# EAGLE design bluz_proto_v2_revA (EAGLE 7.3.0)
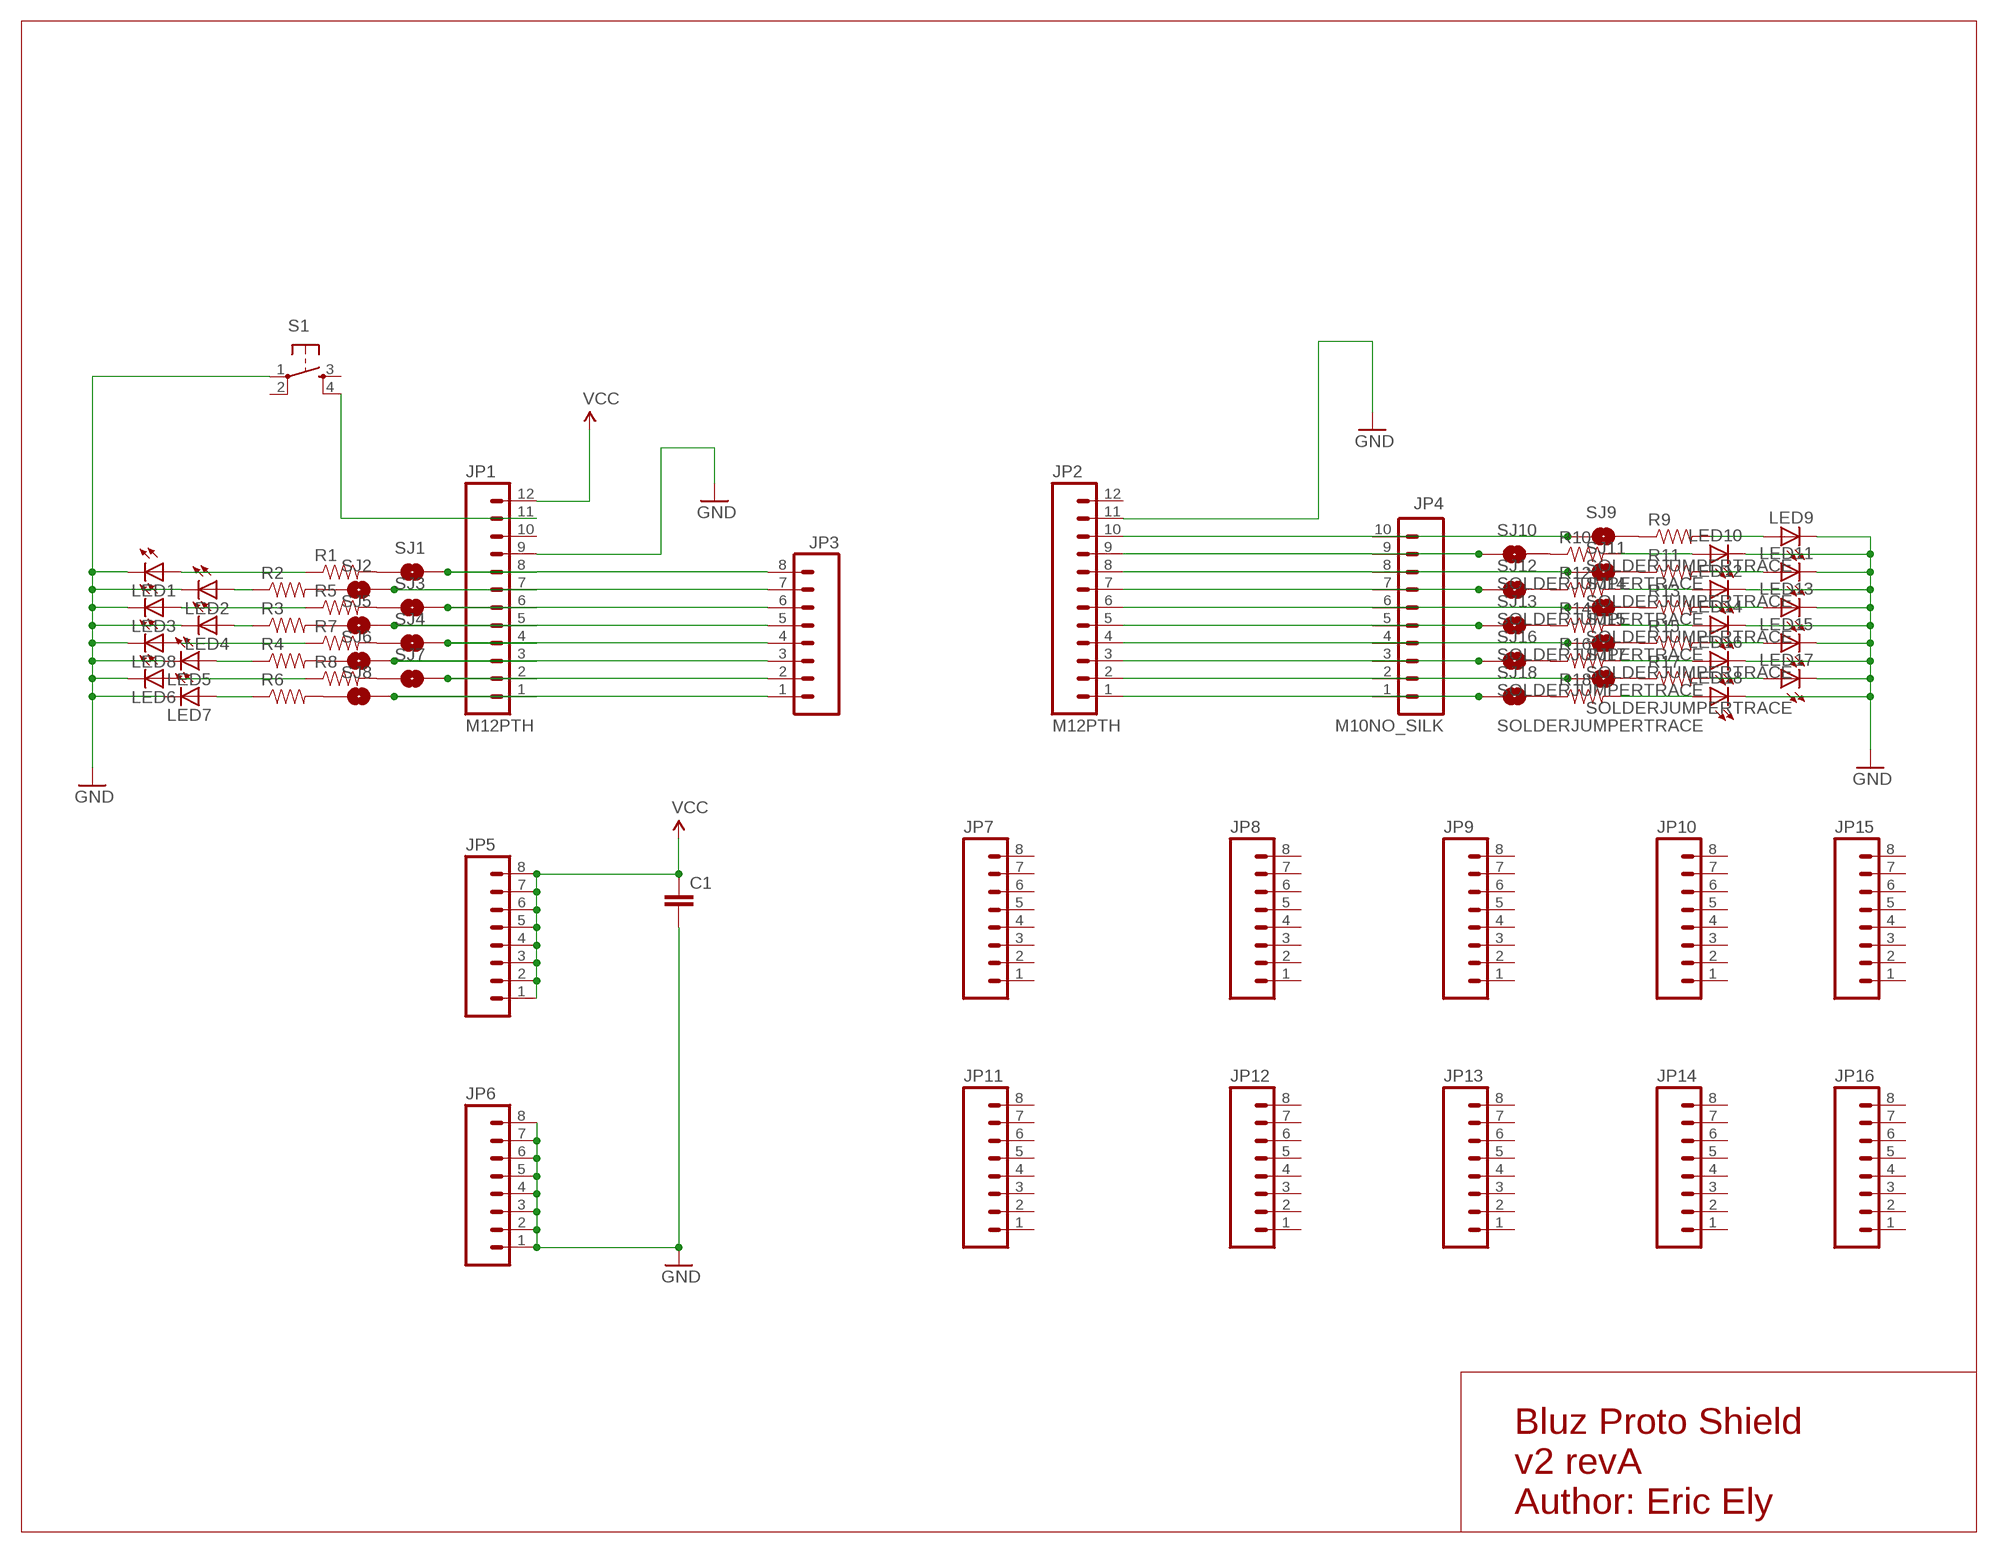
[diagram p0: schematic, sheet 1]

## Parts
C1  CAP0603-CAP  [0603-CAP]
JP1  M12PTH  [1X12]
JP2  M12PTH  [1X12]
JP3  M08NO_SILK  [1X08_NO_SILK]
JP4  M10NO_SILK  [1X10_NO_SILK]
JP5  M08NO_SILK  [1X08_NO_SILK]
JP6  M08NO_SILK  [1X08_NO_SILK]
JP7  M08NO_SILK  [1X08_NO_SILK]
JP8  M08NO_SILK  [1X08_NO_SILK]
JP9  M08NO_SILK  [1X08_NO_SILK]
JP10  M08NO_SILK  [1X08_NO_SILK]
JP11  M08NO_SILK  [1X08_NO_SILK]
JP12  M08NO_SILK  [1X08_NO_SILK]
JP13  M08NO_SILK  [1X08_NO_SILK]
JP14  M08NO_SILK  [1X08_NO_SILK]
JP15  M08NO_SILK  [1X08_NO_SILK]
JP16  M08NO_SILK  [1X08_NO_SILK]
LED1  LEDCHIP-LED0603  [CHIP-LED0603]
LED2  LEDCHIP-LED0603  [CHIP-LED0603]
LED3  LEDCHIP-LED0603  [CHIP-LED0603]
LED4  LEDCHIP-LED0603  [CHIP-LED0603]
LED5  LEDCHIP-LED0603  [CHIP-LED0603]
LED6  LEDCHIP-LED0603  [CHIP-LED0603]
LED7  LEDCHIP-LED0603  [CHIP-LED0603]
LED8  LEDCHIP-LED0603  [CHIP-LED0603]
LED9  LEDCHIP-LED0603  [CHIP-LED0603]
LED10  LEDCHIP-LED0603  [CHIP-LED0603]
LED11  LEDCHIP-LED0603  [CHIP-LED0603]
LED12  LEDCHIP-LED0603  [CHIP-LED0603]
LED13  LEDCHIP-LED0603  [CHIP-LED0603]
LED14  LEDCHIP-LED0603  [CHIP-LED0603]
LED15  LEDCHIP-LED0603  [CHIP-LED0603]
LED16  LEDCHIP-LED0603  [CHIP-LED0603]
LED17  LEDCHIP-LED0603  [CHIP-LED0603]
LED18  LEDCHIP-LED0603  [CHIP-LED0603]
R1  RESISTOR0603-RES  [0603-RES]
R2  RESISTOR0603-RES  [0603-RES]
R3  RESISTOR0603-RES  [0603-RES]
R4  RESISTOR0603-RES  [0603-RES]
R5  RESISTOR0603-RES  [0603-RES]
R6  RESISTOR0603-RES  [0603-RES]
R7  RESISTOR0603-RES  [0603-RES]
R8  RESISTOR0603-RES  [0603-RES]
R9  RESISTOR0603-RES  [0603-RES]
R10  RESISTOR0603-RES  [0603-RES]
R11  RESISTOR0603-RES  [0603-RES]
R12  RESISTOR0603-RES  [0603-RES]
R13  RESISTOR0603-RES  [0603-RES]
R14  RESISTOR0603-RES  [0603-RES]
R15  RESISTOR0603-RES  [0603-RES]
R16  RESISTOR0603-RES  [0603-RES]
R17  RESISTOR0603-RES  [0603-RES]
R18  RESISTOR0603-RES  [0603-RES]
S1  TAC_SWITCHSMD  [TACTILE_SWITCH_SMD]
SJ1  SOLDERJUMPERTRACE  [SJ_2S-TRACE]
SJ2  SOLDERJUMPERTRACE  [SJ_2S-TRACE]
SJ3  SOLDERJUMPERTRACE  [SJ_2S-TRACE]
SJ4  SOLDERJUMPERTRACE  [SJ_2S-TRACE]
SJ5  SOLDERJUMPERTRACE  [SJ_2S-TRACE]
SJ6  SOLDERJUMPERTRACE  [SJ_2S-TRACE]
SJ7  SOLDERJUMPERTRACE  [SJ_2S-TRACE]
SJ8  SOLDERJUMPERTRACE  [SJ_2S-TRACE]
SJ9  SOLDERJUMPERTRACE  [SJ_2S-TRACE]
SJ10  SOLDERJUMPERTRACE  [SJ_2S-TRACE]
SJ11  SOLDERJUMPERTRACE  [SJ_2S-TRACE]
SJ12  SOLDERJUMPERTRACE  [SJ_2S-TRACE]
SJ13  SOLDERJUMPERTRACE  [SJ_2S-TRACE]
SJ14  SOLDERJUMPERTRACE  [SJ_2S-TRACE]
SJ15  SOLDERJUMPERTRACE  [SJ_2S-TRACE]
SJ16  SOLDERJUMPERTRACE  [SJ_2S-TRACE]
SJ17  SOLDERJUMPERTRACE  [SJ_2S-TRACE]
SJ18  SOLDERJUMPERTRACE  [SJ_2S-TRACE]

## Nets
GND: C1.2 JP1.9 JP2.11 JP6.1 JP6.2 JP6.3 JP6.4 JP6.5 JP6.6 JP6.7 JP6.8 LED1.C LED2.C LED3.C LED4.C LED5.C LED6.C LED7.C LED8.C LED9.C LED10.C LED11.C LED12.C LED13.C LED14.C LED15.C LED16.C LED17.C LED18.C S1.1
N$1: JP1.1 JP3.1 SJ8.2
N$2: JP1.2 JP3.2 SJ7.2
N$3: JP1.3 JP3.3 SJ6.2
N$4: JP1.4 JP3.4 SJ4.2
N$5: JP1.5 JP3.5 SJ5.2
N$6: JP1.6 JP3.6 SJ3.2
N$7: JP1.7 JP3.7 SJ2.2
N$8: JP1.8 JP3.8 SJ1.2
N$9: JP2.1 JP4.1 SJ18.1
N$10: JP2.2 JP4.2 SJ17.1
N$11: JP2.3 JP4.3 SJ16.1
N$12: JP2.4 JP4.4 SJ15.1
N$13: JP2.5 JP4.5 SJ13.1
N$14: JP2.6 JP4.6 SJ14.1
N$15: JP2.7 JP4.7 SJ12.1
N$16: JP2.8 JP4.8 SJ11.1
N$17: JP2.9 JP4.9 SJ10.1
N$18: JP2.10 JP4.10 SJ9.1
N$19: LED6.A R8.1
N$20: R1.2 SJ1.1
N$21: R2.2 SJ2.1
N$22: R3.2 SJ5.1
N$23: R4.2 SJ6.1
N$24: R6.2 SJ8.1
N$25: R5.2 SJ3.1
N$26: R7.2 SJ4.1
N$27: R8.2 SJ7.1
N$28: LED1.A R1.1
N$29: LED2.A R2.1
N$30: LED3.A R5.1
N$31: LED4.A R3.1
N$32: LED5.A R4.1
N$33: LED7.A R6.1
N$34: LED8.A R7.1
N$35: R18.1 SJ18.2
N$36: R17.1 SJ17.2
N$37: R16.1 SJ16.2
N$38: R15.1 SJ15.2
N$39: R14.1 SJ13.2
N$40: R13.1 SJ14.2
N$41: R12.1 SJ12.2
N$42: R11.1 SJ11.2
N$43: R10.1 SJ10.2
N$44: R9.1 SJ9.2
N$45: LED9.A R9.2
N$46: LED10.A R10.2
N$47: LED11.A R11.2
N$48: LED12.A R12.2
N$49: LED13.A R13.2
N$50: LED14.A R14.2
N$51: LED15.A R15.2
N$52: LED16.A R16.2
N$53: LED17.A R17.2
N$54: LED18.A R18.2
N$56: JP1.11 S1.4
VCC: C1.1 JP1.12 JP5.1 JP5.2 JP5.3 JP5.4 JP5.5 JP5.6 JP5.7 JP5.8
Unconnected: JP1.10 JP2.12 JP7.1 JP7.2 JP7.3 JP7.4 JP7.5 JP7.6 JP7.7 JP7.8 JP8.1 JP8.2 JP8.3 JP8.4 JP8.5 JP8.6 JP8.7 JP8.8 JP9.1 JP9.2 JP9.3 JP9.4 JP9.5 JP9.6 JP9.7 JP9.8 JP10.1 JP10.2 JP10.3 JP10.4 JP10.5 JP10.6 JP10.7 JP10.8 JP11.1 JP11.2 JP11.3 JP11.4 JP11.5 JP11.6 JP11.7 JP11.8 JP12.1 JP12.2 JP12.3 JP12.4 JP12.5 JP12.6 JP12.7 JP12.8 JP13.1 JP13.2 JP13.3 JP13.4 JP13.5 JP13.6 JP13.7 JP13.8 JP14.1 JP14.2 JP14.3 JP14.4 JP14.5 JP14.6 JP14.7 JP14.8 JP15.1 JP15.2 JP15.3 JP15.4 JP15.5 JP15.6 JP15.7 JP15.8 JP16.1 JP16.2 JP16.3 JP16.4 JP16.5 JP16.6 JP16.7 JP16.8 S1.2 S1.3

## Notes on the sheet
- Bluz Proto Shield
  v2 revA
  Author: Eric Ely

## Library data of the parts
C1 = SparkFun-Capacitors:CAP: Capacitor Standard 0603 ceramic capacitor, and 0.1" leaded capacitor.
JP1 JP2 = SparkFun-Connectors:M12: Header 12 Standard 12-pin 0.1" header. Use with straight break away headers (SKU : PRT-00116), right angle break away headers (PRT-00553), swiss pins (PRT-00743), machine pins (PRT-00117), and female headers (PRT-00115).
JP3 JP5-JP16 = SparkFun-Connectors:M08: Header 8 Standard 8-pin 0.1" header. Use with straight break away headers (SKU : PRT-00116), right angle break away headers (PRT-00553), swiss pins (PRT-00743), machine pins (PRT-00117), and female headers (PRT-00115).
JP4 = SparkFun-Connectors:M10: Header 10 Standard 10-pin 0.1" header. Use with straight break away headers (SKU : PRT-00116), right angle break away headers (PRT-00553), swiss pins (PRT-00743), machine pins (PRT-00117), and female headers (PRT-00115).
LED1-LED18 = led:LED: LED OSRAM: - CHIPLED LG R971, LG N971, LY N971, LG Q971, LY Q971, LO R971, LY R971 LH N974, LH R974 LS Q976, LO Q976, LY Q976 LO Q996 - Hyper CHIPLED LW Q18S LB Q993, LB Q99A, LB R99A - SideLED LS A670, LO A670, LY A670, LG A670, LP A670 LB A673, LV A673, LT A673, LW A673 LH A674 LY A675 LS A676, LA A676, LO A676, LY A676, LW A676 LS A679, LY A679, LG A679 - Hyper Micro SIDELED® LS Y876, LA Y876, LO Y876, LY Y876 LT Y87S - SmartLED LW L88C, LW L88S LB L89C, LB L89S, LG L890 LS L89K, LO L89K, LY L89K LS L896, LA L896, LO L896, LY L896 - TOPLED LS T670, LO T670, LY T670, LG T670, LP T670 LSG T670, LSP T670, LSY T670, LOP T670, LYG T670 LG T671, LOG T671, LSG T671 LB T673, LV T673, LT T673, LW T673 LH T674 LS T676, LA T676, LO T676, LY T676, LB T676, LH T676, LSB T676, LW T676 LB T67C, LV T67C, LT T67C, LS T67K, LO T67K, LY T67K, LW E67C LS E67B, LA E67B, LO E67B, LY E67B, LB E67C, LV E67C, LT E67C LW T67C LS T679, LY T679, LG T679 LS T770, LO T770, LY T770, LG T770, LP T770 LB T773, LV T773, LT T773, LW T773 LH T774 LS E675, LA E675, LY E675, LS T675 LS T776, LA T776, LO T776, LY T776, LB T776 LHGB T686 LT T68C, LB T68C - Hyper Mini TOPLED® LB M676 - Mini TOPLED Santana® LG M470 LS M47K, LO M47K, LY M47K Source: http://www.osram.convergy.de LUXEON: - LUMILED® LXK2-PW12-R00, LXK2-PW12-S00, LXK2-PW14-U00, LXK2-PW14-V00 LXK2-PM12-R00, LXK2-PM12-S00, LXK2-PM14-U00 LXK2-PE12-Q00, LXK2-PE12-R00, LXK2-PE12-S00, LXK2-PE14-T00, LXK2-PE14-U00 LXK2-PB12-K00, LXK2-PB12-L00, LXK2-PB12-M00, LXK2-PB14-N00, LXK2-PB14-P00, LXK2-PB14-Q00 LXK2-PR12-L00, LXK2-PR12-M00, LXK2-PR14-Q00, LXK2-PR14-R00 LXK2-PD12-Q00, LXK2-PD12-R00, LXK2-PD12-S00 LXK2-PH12-R00, LXK2-PH12-S00 LXK2-PL12-P00, LXK2-PL12-Q00, LXK2-PL12-R00 Source: www.luxeon.com KINGBRIGHT: KA-3528ASYC Source: www.kingbright.com
R1-R18 = SparkFun-Passives:RESISTOR: Resistor Basic schematic elements and footprints for 0603, 1206, and PTH resistors.
S1 = Spark:TAC_SWITCH: SMD Tactiile Switch
SJ1-SJ18 = SparkFun-Passives:SOLDERJUMPER: Solder Jumper Standard SMD solder jumper. Used to automate production. Two varients : Normally Open and Normally Closed are the same, but have different paste layers. NC will have a large amount of paste and should jumper during reflow.

## Board
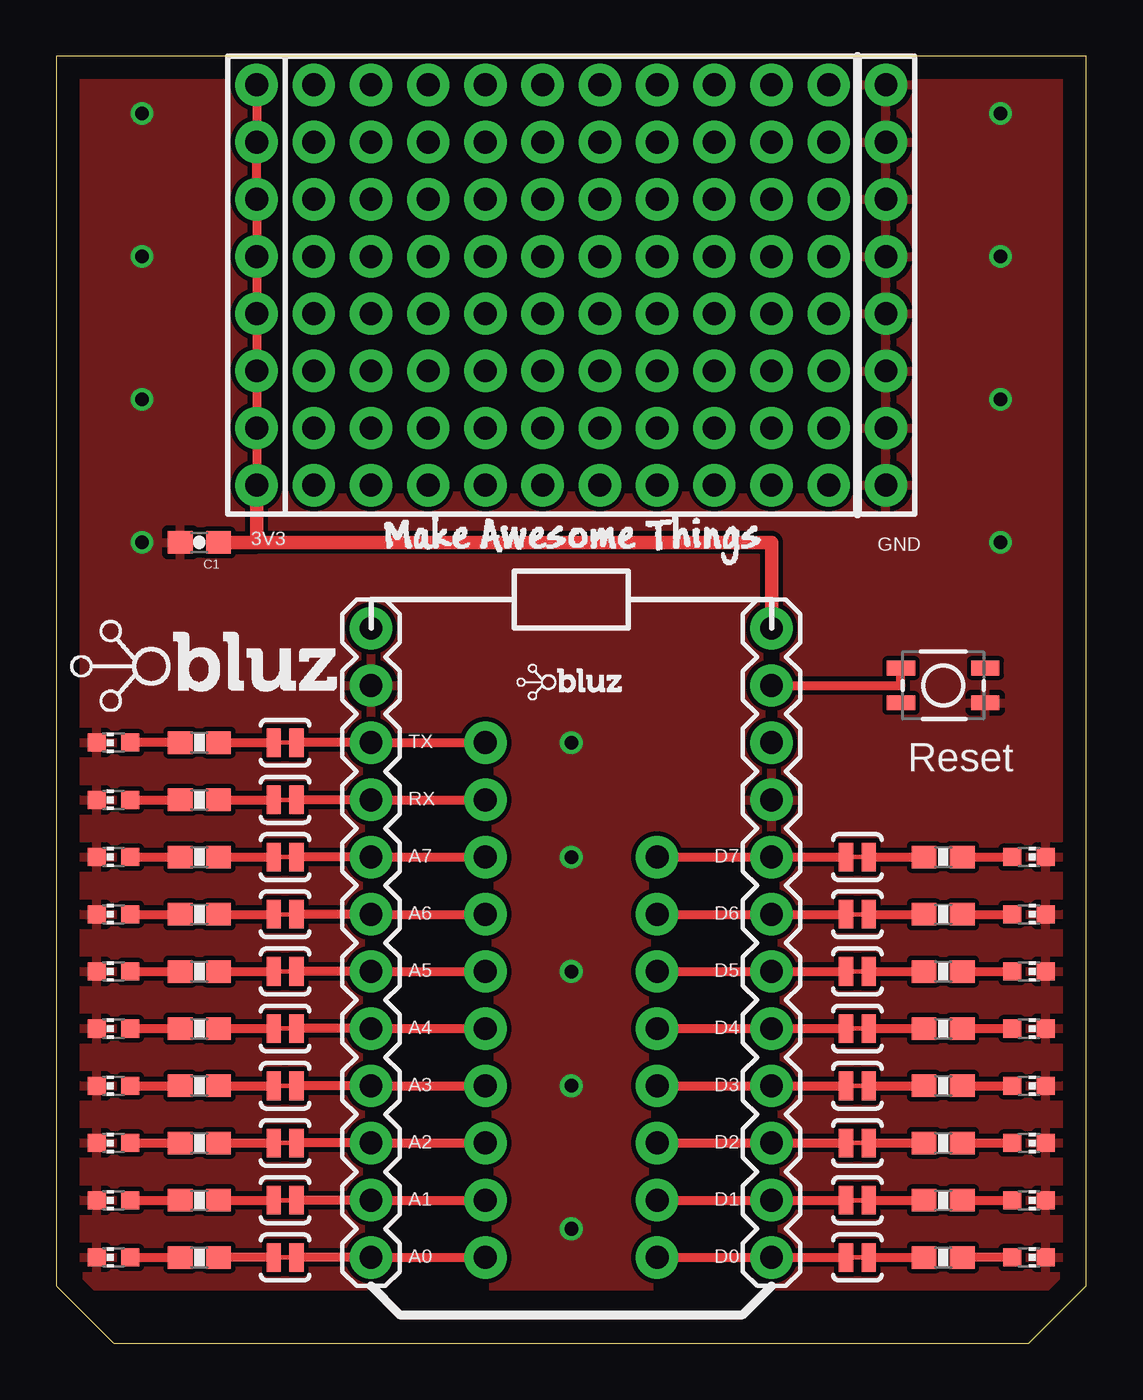
[diagram p1: board, top side]
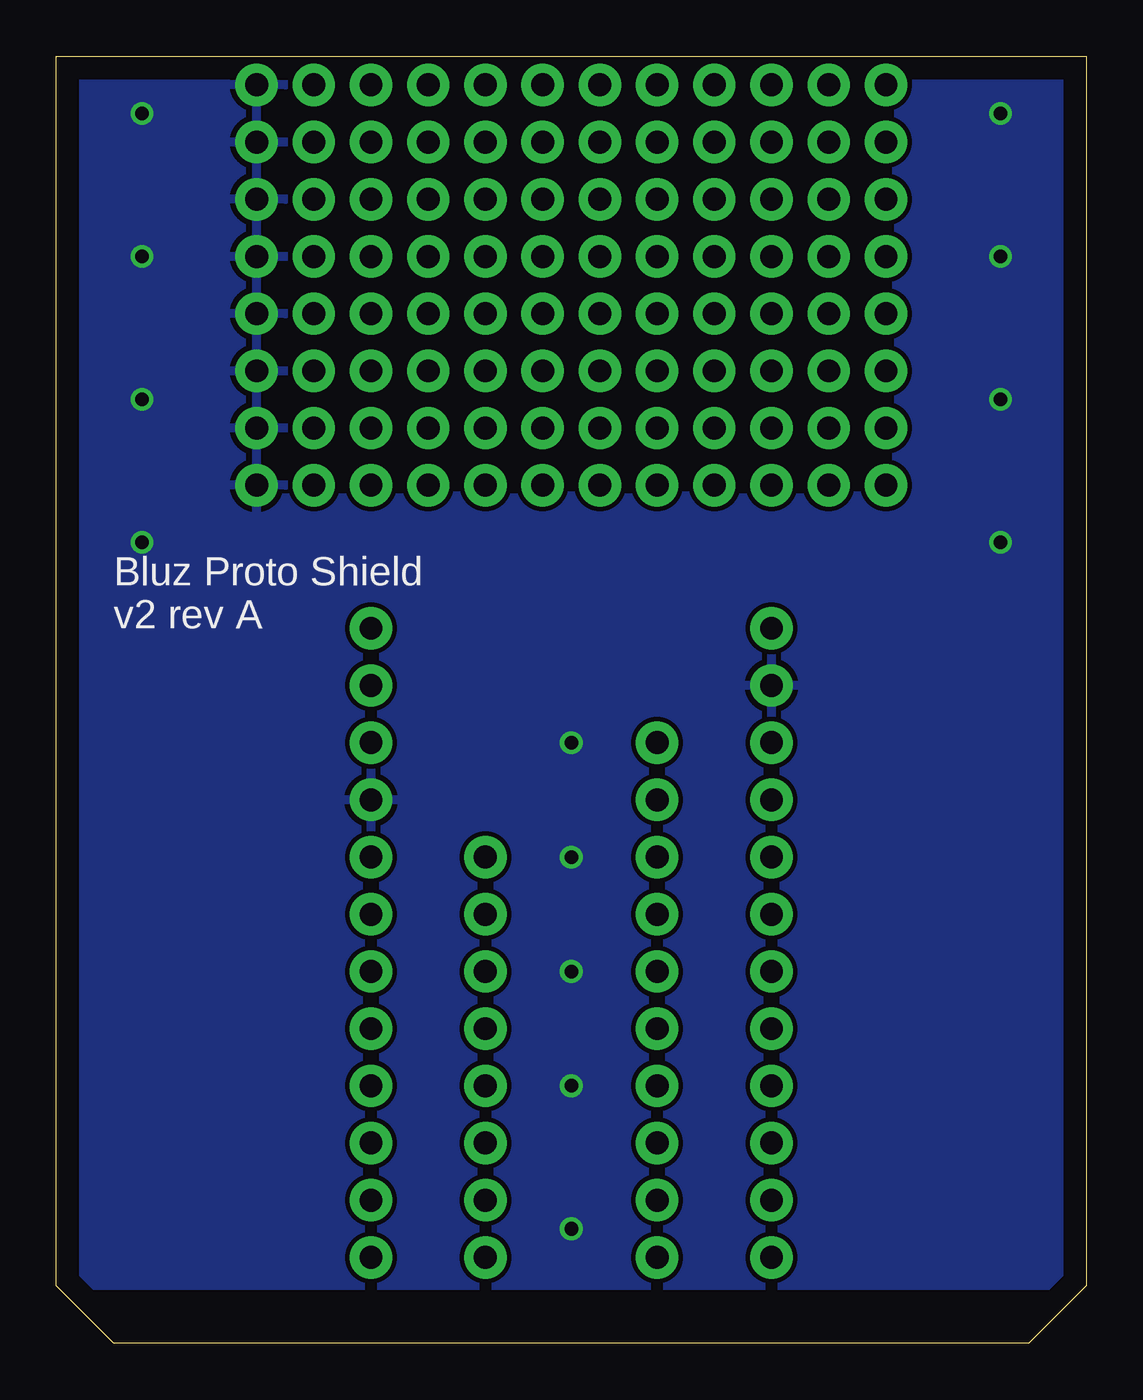
[diagram p2: board, bottom side, seen from below]

Size 45.72 x 57.15 mm. Coordinates in mm from the lower left corner, seen from the top.
Outline: 0,2.54 2.54,0 43.18,0 45.72,2.54 45.72,57.15 0,57.15 0,2.54
Copper layers (1*16): Top 0.035mm / dielectric 1.5mm / Bottom 0.035mm
Design rules "default": minimum track width 10mil, minimum drill 24mil, track to track 8mil, track to pad 8mil, pad to pad 8mil, via to via 8mil, smd to smd 8mil, copper to edge 40mil, drill to drill 8mil, minimum pad ring 10mil, minimum via ring 8mil, stop-mask expansion 4mil, vias tented up to drill 0mil, thermal gap 10mil

### Footprints (pad centres in the part's own frame; a part is rotated, then mirrored left to right if it is on the bottom)
0603-CAP = smd 1.1 x 1: 1 -0.85,0; 2 0.85,0
1X12 = drill 1.016 pad 1.88: 1 0,0; 2 2.54,0; 3 5.08,0; 4 7.62,0; 5 10.16,0; 6 12.7,0; 7 15.24,0; 8 17.78,0; 9 20.32,0; 10 22.86,0; 11 25.4,0; 12 27.94,0
1X08_NO_SILK = drill 1.016 pad 1.88: 1 0,0; 2 2.54,0; 3 5.08,0; 4 7.62,0; 5 10.16,0; 6 12.7,0; 7 15.24,0; 8 17.78,0
1X10_NO_SILK = drill 1.016 pad 1.88: 1 0,0; 2 2.54,0; 3 5.08,0; 4 7.62,0; 5 10.16,0; 6 12.7,0; 7 15.24,0; 8 17.78,0; 9 20.32,0; 10 22.86,0
CHIP-LED0603 = smd 0.8 x 0.8: A 0,-0.75; C 0,0.75
0603-RES = smd 1.1 x 1: 1 -0.85,0; 2 0.85,0
TACTILE_SWITCH_SMD = smd 1.25 x 0.65: 1 -1.875,0.775; 2 1.875,0.775; 3 -1.875,-0.775; 4 1.875,-0.775
SJ_2S-TRACE = smd 0.635 x 1.27: 1 -0.508,0; 2 0.508,0

### Placement (x,y rotation side)
C1  6.35,35.56 180 top
JP1  31.75,3.81 90 top
JP2  13.97,3.81 90 top
JP3  26.67,3.81 90 top
JP4  19.05,3.81 90 top
JP5  8.89,38.1 90 top
JP6  36.83,38.1 90 top
JP7  21.59,38.1 90 top
JP8  24.13,38.1 90 top
JP9  26.67,38.1 90 top
JP10  19.05,38.1 90 top
JP11  29.21,38.1 90 top
JP12  16.51,38.1 90 top
JP13  31.75,38.1 90 top
JP14  13.97,38.1 90 top
JP15  11.43,38.1 90 top
JP16  34.29,38.1 90 top
LED1  43.18,21.59 270 top
LED2  43.18,19.05 270 top
LED3  43.18,16.51 270 top
LED4  43.18,13.97 270 top
LED5  43.18,8.89 270 top
LED6  43.18,6.35 270 top
LED7  43.18,3.81 270 top
LED8  43.18,11.43 270 top
LED9  2.54,26.67 90 top
LED10  2.54,24.13 90 top
LED11  2.54,21.59 90 top
LED12  2.54,19.05 90 top
LED13  2.54,16.51 90 top
LED14  2.54,13.97 90 top
LED15  2.54,11.43 90 top
LED16  2.54,8.89 90 top
LED17  2.54,6.35 90 top
LED18  2.54,3.81 90 top
R1  39.37,21.59 180 top
R2  39.37,19.05 180 top
R3  39.37,13.97 180 top
R4  39.37,8.89 180 top
R5  39.37,16.51 180 top
R6  39.37,3.81 180 top
R7  39.37,11.43 180 top
R8  39.37,6.35 180 top
R9  6.35,26.67 180 top
R10  6.35,24.13 180 top
R11  6.35,21.59 180 top
R12  6.35,19.05 180 top
R13  6.35,16.51 180 top
R14  6.35,13.97 180 top
R15  6.35,11.43 180 top
R16  6.35,8.89 180 top
R17  6.35,6.35 180 top
R18  6.35,3.81 180 top
S1  39.37,29.21 180 top
SJ1  35.56,21.59 180 top
SJ2  35.56,19.05 180 top
SJ3  35.56,16.51 180 top
SJ4  35.56,11.43 180 top
SJ5  35.56,13.97 180 top
SJ6  35.56,8.89 180 top
SJ7  35.56,6.35 180 top
SJ8  35.56,3.81 180 top
SJ9  10.16,26.67 180 top
SJ10  10.16,24.13 180 top
SJ11  10.16,21.59 180 top
SJ12  10.16,19.05 180 top
SJ13  10.16,13.97 180 top
SJ14  10.16,16.51 180 top
SJ15  10.16,11.43 180 top
SJ16  10.16,8.89 180 top
SJ17  10.16,6.35 180 top
SJ18  10.16,3.81 180 top
U$2  [BLUZ_LOGO_BETTER]  0.64,28.07 0 top
U$3  [BLUZE_LOGO_LOW_RES]  20.45,28.57 0 top
U$4  [MAKE_X2]  14.22,34.54 0 top

### Tracks (layer width: path | path; a pad name or v marks a point on that pad's centre or on a via)
GND  (via drill 0.6)
  other vias: 3.81,54.61 3.81,48.26 3.81,41.91 3.81,35.56 41.91,54.61 41.91,48.26 41.91,41.91 41.91,35.56 22.86,26.67 22.86,21.59 22.86,16.51 22.86,11.43 22.86,5.08
  pour Top: 0,57.15 0,2.54 45.72,2.54 45.72,57.15
  pour Bottom: 0,57.15 0,2.54 45.72,2.54 45.72,57.15
N$1
  Top 0.406: JP3.1 JP1.1 SJ8.2
N$2
  Top 0.406: JP3.2 JP1.2 SJ7.2
N$3
  Top 0.406: JP3.3 JP1.3 SJ6.2
N$4
  Top 0.406: JP3.4 JP1.4 SJ4.2
N$5
  Top 0.406: JP3.5 JP1.5 SJ5.2
N$6
  Top 0.406: JP3.6 JP1.6 SJ3.2
N$7
  Top 0.406: JP3.7 JP1.7 SJ2.2
N$8
  Top 0.406: JP3.8 JP1.8 SJ1.2
N$9
  Top 0.406: JP4.1 JP2.1 SJ18.1
N$10
  Top 0.406: JP4.2 JP2.2 SJ17.1
N$11
  Top 0.406: JP4.3 JP2.3 SJ16.1
N$12
  Top 0.406: JP4.4 JP2.4 SJ15.1
N$13
  Top 0.406: JP4.5 JP2.5 SJ13.1
N$14
  Top 0.406: JP4.6 JP2.6 SJ14.1
N$15
  Top 0.406: JP4.7 JP2.7 SJ12.1
N$16
  Top 0.406: JP4.8 JP2.8 SJ11.1
N$17
  Top 0.406: JP4.9 JP2.9 SJ10.1
N$18
  Top 0.406: JP4.10 JP2.10 SJ9.1
N$19
  Top 0.406: R8.1 LED6.A
N$20
  Top 0.406: SJ1.1 R1.2
N$21
  Top 0.406: SJ2.1 R2.2
N$22
  Top 0.406: SJ5.1 R3.2
N$23
  Top 0.406: SJ6.1 R4.2
N$24
  Top 0.406: SJ8.1 R6.2
N$25
  Top 0.406: SJ3.1 R5.2
N$26
  Top 0.406: SJ4.1 R7.2
N$27
  Top 0.406: SJ7.1 R8.2
N$28
  Top 0.406: R1.1 LED1.A
N$29
  Top 0.406: R2.1 LED2.A
N$30
  Top 0.406: R5.1 LED3.A
N$31
  Top 0.406: R3.1 LED4.A
N$32
  Top 0.406: R4.1 LED5.A
N$33
  Top 0.406: LED7.A R6.1
N$34
  Top 0.406: R7.1 LED8.A
N$35
  Top 0.406: SJ18.2 R18.1
N$36
  Top 0.406: R17.1 SJ17.2
N$37
  Top 0.406: R16.1 SJ16.2
N$38
  Top 0.406: R15.1 SJ15.2
N$39
  Top 0.406: R14.1 SJ13.2
N$40
  Top 0.406: R13.1 SJ14.2
N$41
  Top 0.406: R12.1 SJ12.2
N$42
  Top 0.406: R11.1 SJ11.2
N$43
  Top 0.406: R10.1 SJ10.2
N$44
  Top 0.406: R9.1 SJ9.2
N$45
  Top 0.406: R9.2 LED9.A
N$46
  Top 0.406: LED10.A R10.2
N$47
  Top 0.406: LED11.A R11.2
N$48
  Top 0.406: LED12.A R12.2
N$49
  Top 0.406: LED13.A R13.2
N$50
  Top 0.406: LED14.A R14.2
N$51
  Top 0.406: LED15.A R15.2
N$52
  Top 0.406: LED16.A R16.2
N$53
  Top 0.406: LED17.A R17.2
N$54
  Top 0.406: LED18.A R18.2
N$56
  Top 0.406: JP1.11 37.49,29.21 S1.4
VCC
  Top 0.406: JP5.1 JP5.2 JP5.3 JP5.4 JP5.5 JP5.6 JP5.7 JP5.8
  Top 0.61: JP1.12 31.75,35.56 10.16,35.56 8.89,35.56 | 8.89,35.56 JP5.1 | C1.1 8.89,35.56

### Text on the board
tPlace: Reset
bPlace: Bluz Proto Shield / v2 rev A
tNames: 3V3 | GND | TX | RX | A7 | D7 | A6 | D6 | A5 | D5 | A4 | D4 | A3 | D3 | A2 | D2 | A1 | D1 | A0 | D0